# Altium schematic sheet Mini_Mainboard_sch.SchDoc
size A3
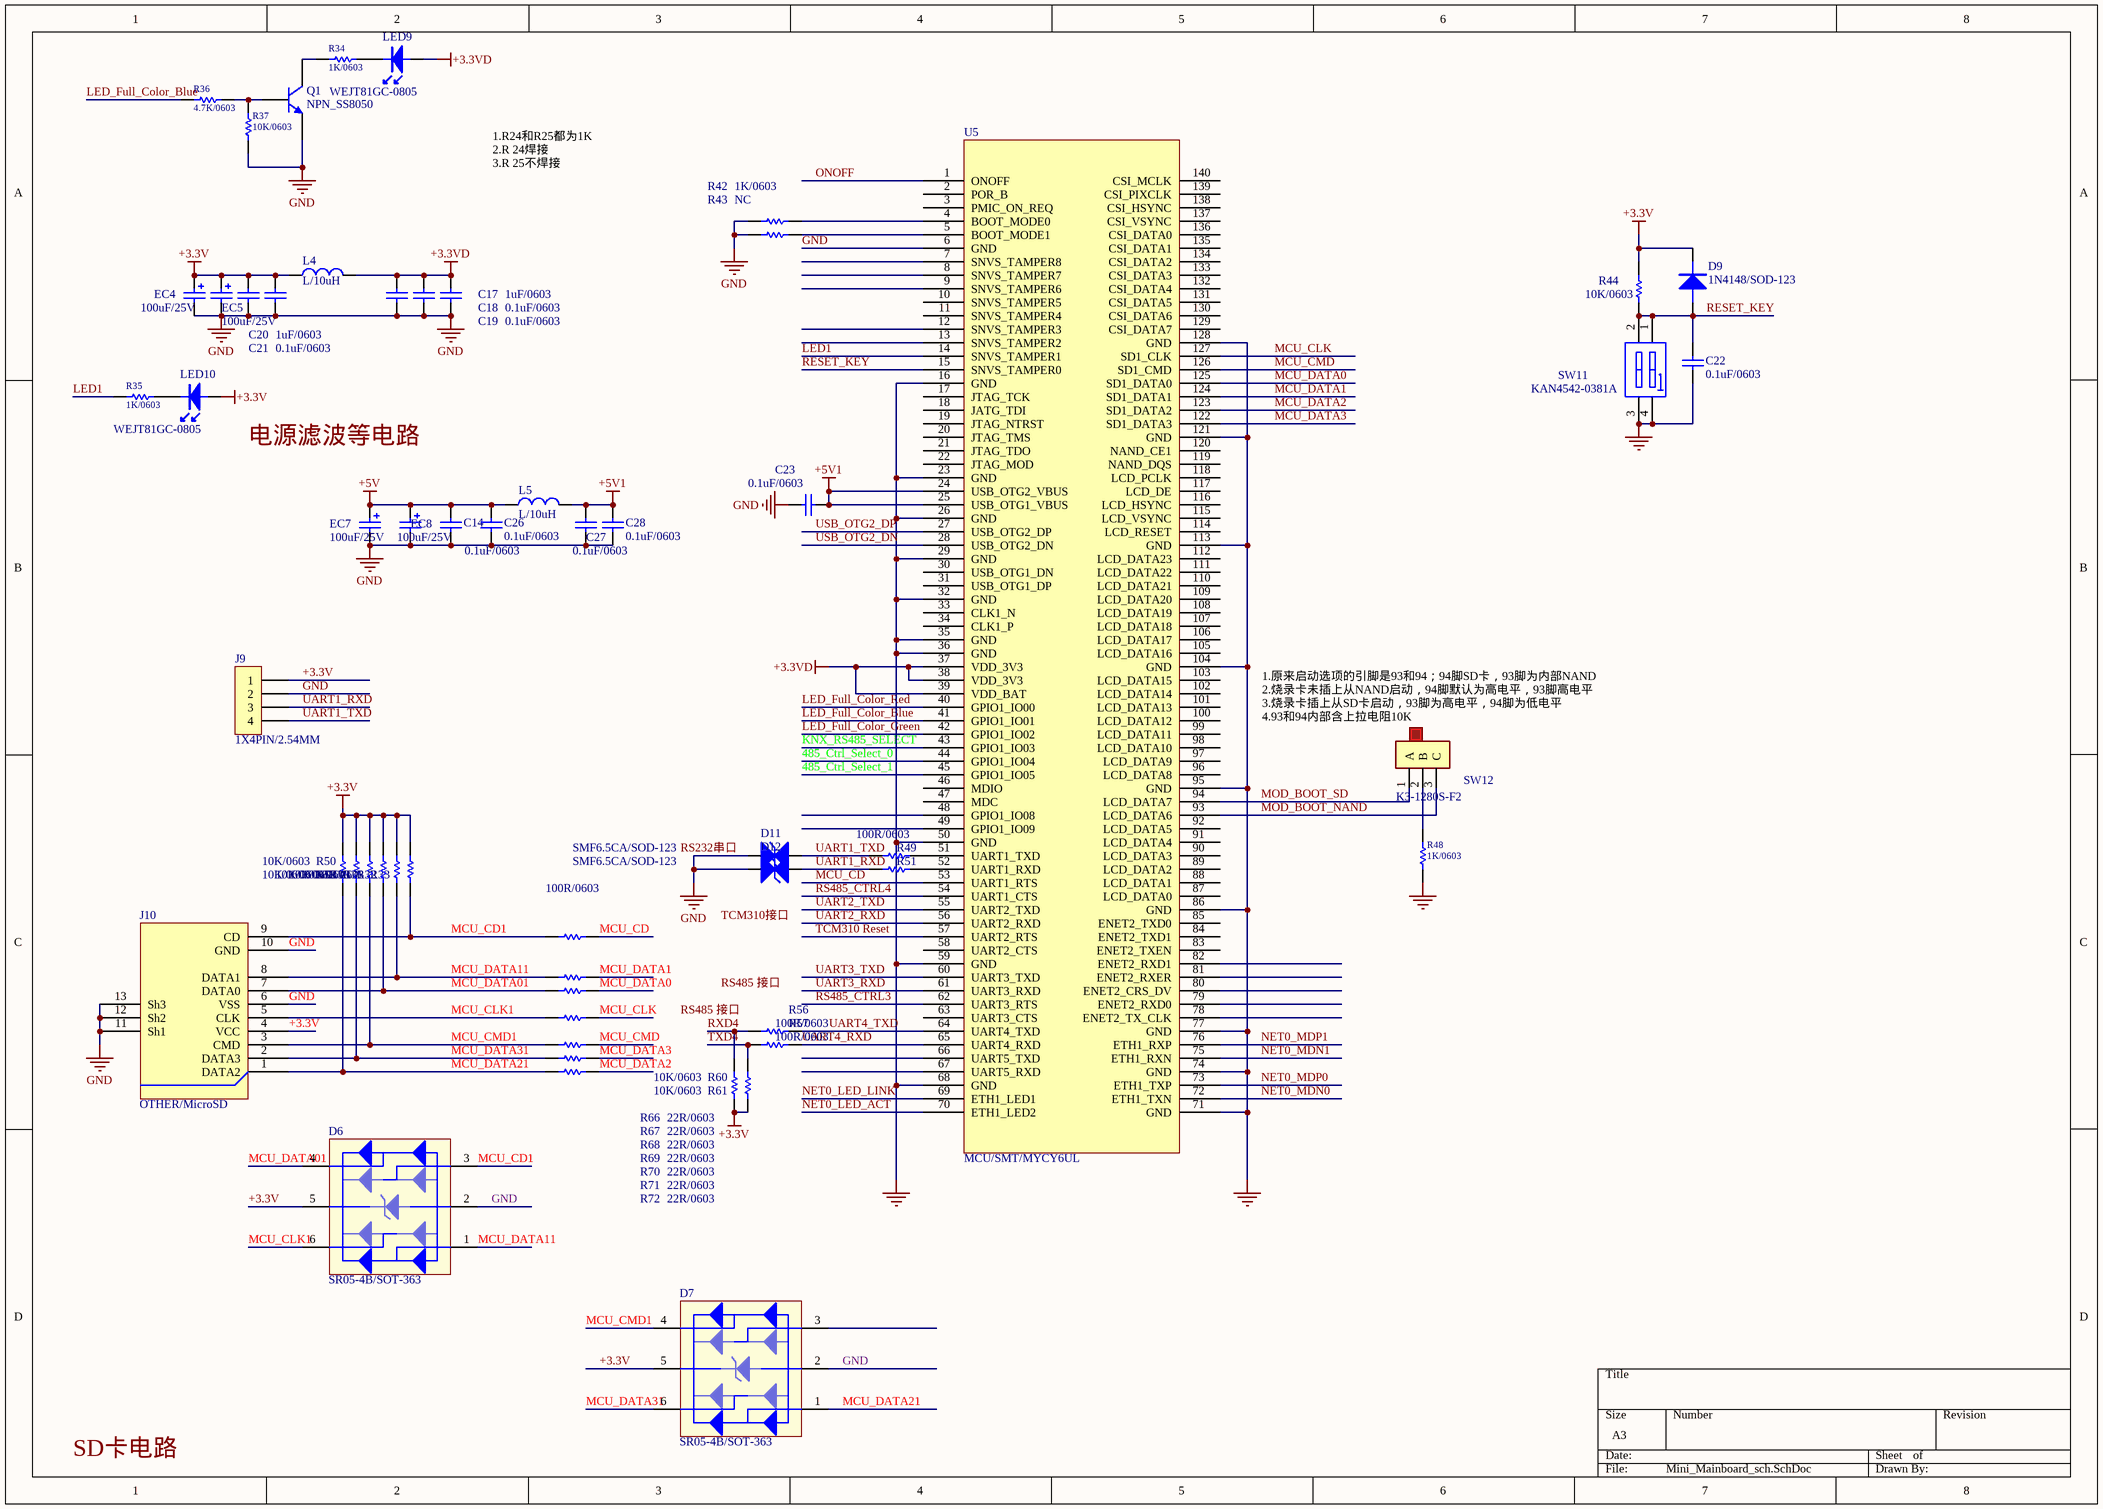
[diagram p0: Mini_Mainboard_sch.SchDoc]

## Parts
C14  0.1uF/0603  [CAP/SMT/0603C]
C17  1uF/0603  [CAP/SMT/0603C]
C18  0.1uF/0603  [CAP/SMT/0603C]
C19  0.1uF/0603  [CAP/SMT/0603C]
C20  1uF/0603  [CAP/SMT/0603C]
C21  0.1uF/0603  [CAP/SMT/0603C]
C22  0.1uF/0603  [CAP/SMT/0603C]
C23  0.1uF/0603  [CAP/SMT/0603C]
C26  0.1uF/0603  [CAP/SMT/0603C]
C27  0.1uF/0603  [CAP/SMT/0603C]
C28  0.1uF/0603  [CAP/SMT/0603C]
D6  SR05-4B/SOT-363  [TSOT-6L]
D7  SR05-4B/SOT-363  [TSOT-6L]
D9  1N4148/SOD-123  [D/SMT/SOD-123]
D11  SMF6.5CA/SOD-123  [D/SMT/SOD123]
D12  SMF6.5CA/SOD-123  [D/SMT/SOD123]
EC4  100uF/25V  [CAP/SMT/100UF/25V]
EC5  100uF/25V  [CAP/SMT/100UF/25V]
EC7  100uF/25V  [CAP/SMT/100UF/25V]
EC8  100uF/25V  [CAP/SMT/100UF/25V]
J9  1X4PIN/2.54MM  [CON/DIP/1×4PIN/2.54MM/插件端子]
J10  OTHER/MicroSD  [TF-01A]
L4  L/10uH  [L/SMT/0603L]
L5  L/10uH  [L/SMT/0603L]
LED9  WEJT81GC-0805  [D/SMT/LED/0805]
LED10  WEJT81GC-0805  [D/SMT/LED/0805]
Q1  NPN_SS8050  [BJT/SMT/SOT-23]
R30  10K/0603  [0603R]
R31  10K/0603  [0603R]
R32  10K/0603  [0603R]
R33  10K/0603  [0603R]
R34  1K/0603  [0603R]
R35  1K/0603  [0603R]
R36  4.7K/0603  [0603R]
R37  10K/0603  [0603R]
R42  1K/0603  [0603R]
R43  NC  [0603R]
R44  10K/0603  [0603R]
R48  1K/0603  [0603R]
R49  100R/0603  [0603R]
R50  10K/0603  [0603R]
R51  100R/0603  [0603R]
R52  10K/0603  [0603R]
R56  100R/0603  [0603R]
R57  100R/0603  [0603R]
R60  10K/0603  [0603R]
R61  10K/0603  [0603R]
R66  22R/0603  [0603R]
R67  22R/0603  [0603R]
R68  22R/0603  [0603R]
R69  22R/0603  [0603R]
R70  22R/0603  [0603R]
R71  22R/0603  [0603R]
R72  22R/0603  [0603R]
SW11  KAN4542-0381A  [SWITCH/KAN4542]
SW12  K3-1280S-F2  [SWITCH/K3-1280S-F2]
U5  MCU/SMT/MYCY6UL  [MYC140]

## Nets
+3.3V: C20.2 C21.2 D6.5 D7.5 D9.1(K) EC4.1 EC5.1 J9.1 J10.4(VCC) L4.1 LED10.2(A) R30.2 R31.2 R32.2 R33.2 R44.2 R50.2 R52.2 R60.2 R61.2
+3.3VD: C17.2 C18.2 C19.2 L4.2 LED9.2(A) U5.37(VDD_3V3) U5.38(VDD_3V3) U5.39(VDD_BAT)
+5V: C14.2 C26.2 EC7.1 EC8.1 L5.1
+5V1: C23.2 C27.2 C28.2 L5.2 U5.24(USB_OTG2_VBUS) U5.25(USB_OTG1_VBUS)
GND: C14.1 C17.1 C18.1 C19.1 C20.1 C21.1 C22.1 C23.1 C26.1 C27.1 C28.1 D6.2 D7.2 D11.2(K) D12.2(K) EC4.2 EC5.2 EC7.2 EC8.2 J9.2 J10.6(VSS) J10.10(GND) J10.11(Sh1) J10.12(Sh2) J10.13(Sh3) Q1.2(E) R37.1 R42.2 R43.2 R48.1 SW11.3(B2) SW11.4(B1) U5.6(GND) U5.16(GND) U5.23(GND) U5.26(GND) U5.29(GND) U5.32(GND) U5.35(GND) U5.36(GND) U5.50(GND) U5.59(GND) U5.68(GND) U5.71(GND) U5.74(GND) U5.77(GND) U5.86(GND) U5.95(GND) U5.104(GND) U5.113(GND) U5.121(GND) U5.128(GND)
485_Ctrl_Select_0: U5.44(GPIO1_IO04)
485_Ctrl_Select_1: U5.45(GPIO1_IO05)
KNX_RS485_SELECT: U5.43(GPIO1_IO03)
LED1: R35.1 U5.14(SNVS_TAMPER1)
LED_Full_Color_Blue: R36.1 U5.41(GPIO1_IO01)
LED_Full_Color_Green: U5.42(GPIO1_IO02)
LED_Full_Color_Red: U5.40(GPIO1_IO00)
MCU_CD: R66.1 U5.53(UART1_RTS)
MCU_CD1: D6.3 J10.9(CD) R33.1 R66.2
MCU_CLK: R69.1 U5.127(SD1_CLK)
MCU_CLK1: D6.6 J10.5(CLK) R69.2
MCU_CMD: R70.1 U5.126(SD1_CMD)
MCU_CMD1: D7.4 J10.3(CMD) R30.1 R70.2
MCU_DATA0: R68.1 U5.125(SD1_DATA0)
MCU_DATA01: D6.4 J10.7(DATA0) R31.1 R68.2
MCU_DATA1: R67.1 U5.124(SD1_DATA1)
MCU_DATA2: R72.1 U5.123(SD1_DATA2)
MCU_DATA3: R71.1 U5.122(SD1_DATA3)
MCU_DATA11: D6.1 J10.8(DATA1) R32.1 R67.2
MCU_DATA21: D7.1 J10.1(DATA2) R50.1 R72.2
MCU_DATA31: D7.6 J10.2(DATA3) R52.1 R71.2
MOD_BOOT_NAND: SW12.3(C) U5.93(LCD_DATA6)
MOD_BOOT_SD: SW12.1(A) U5.94(LCD_DATA7)
NET0_LED_ACT: U5.70(ETH1_LED2)
NET0_LED_LINK: U5.69(ETH1_LED1)
NET0_MDN0: U5.72(ETH1_TXN)
NET0_MDN1: U5.75(ETH1_RXN)
NET0_MDP0: U5.73(ETH1_TXP)
NET0_MDP1: U5.76(ETH1_RXP)
ONOFF: U5.1(ONOFF)
RESET_KEY: C22.2 D9.2(A) R44.1 SW11.1(A1) SW11.2(A2) U5.15(SNVS_TAMPER0)
RS485_CTRL3: U5.62(UART3_RTS)
RS485_CTRL4: U5.54(UART1_CTS)
RXD4: R56.2 R60.1
TCM310 Reset: U5.57(UART2_RTS)
TXD4: R57.2 R61.1
UART1_RXD: D12.1(A) J9.3 R51.1
UART1_TXD: D11.1(A) J9.4 R49.1
UART2_RXD: U5.56(UART2_RXD)
UART2_TXD: U5.55(UART2_TXD)
UART3_RXD: U5.61(UART3_RXD)
UART3_TXD: U5.60(UART3_TXD)
UART4_RXD: R57.1 U5.65(UART4_RXD)
UART4_TXD: R56.1 U5.64(UART4_TXD)
USB_OTG2_DN: U5.28(USB_OTG2_DN)
USB_OTG2_DP: U5.27(USB_OTG2_DP)
NetLED9_1: LED9.1(K) R34.1
NetLED10_1: LED10.1(K) R35.2
NetQ1_1: Q1.1(B) R36.2 R37.2
NetQ1_3: Q1.3(C) R34.2
NetR42_1: R42.1 U5.4(BOOT_MODE0)
NetR43_1: R43.1 U5.5(BOOT_MODE1)
NetR48_2: R48.2 SW12.2(B)
NetR49_2: R49.2 U5.51(UART1_TXD)
NetR51_2: R51.2 U5.52(UART1_RXD)

Not connected (* = marked no-connect by the designer): D7 3; U5 2(POR_B) 3(PMIC_ON_REQ) 7(SNVS_TAMPER8) 8(SNVS_TAMPER7) 9(SNVS_TAMPER6) 10(SNVS_TAMPER5) 11(SNVS_TAMPER4) 12(SNVS_TAMPER3) 13(SNVS_TAMPER2) 17(JTAG_TCK) 18(JATG_TDI) 19(JTAG_NTRST) 20(JTAG_TMS) 21(JTAG_TDO) 22(JTAG_MOD) 30(USB_OTG1_DN) 31(USB_OTG1_DP) 33(CLK1_N) 34(CLK1_P) 46(MDIO) 47(MDC) 48(GPIO1_IO08) 49(GPIO1_IO09) 58(UART2_CTS) 63(UART3_CTS) 66(UART5_TXD) 67(UART5_RXD) 78(ENET2_TX_CLK) 79(ENET2_RXD0) 80(ENET2_CRS_DV) 81(ENET2_RXER) 82(ENET2_RXD1) 83(ENET2_TXEN) 84(ENET2_TXD1) 85(ENET2_TXD0) 87(LCD_DATA0) 88(LCD_DATA1) 89(LCD_DATA2) 90(LCD_DATA3) 91(LCD_DATA4) 92(LCD_DATA5) 96(LCD_DATA8) 97(LCD_DATA9) 98(LCD_DATA10) 99(LCD_DATA11) 100(LCD_DATA12) 101(LCD_DATA13) 102(LCD_DATA14) 103(LCD_DATA15) 105(LCD_DATA16) 106(LCD_DATA17) 107(LCD_DATA18) 108(LCD_DATA19) 109(LCD_DATA20) 110(LCD_DATA21) 111(LCD_DATA22) 112(LCD_DATA23) 114(LCD_RESET) 115(LCD_VSYNC) 116(LCD_HSYNC) 117(LCD_DE) 118(LCD_PCLK) 119(NAND_DQS) 120(NAND_CE1) 129(CSI_DATA7) 130(CSI_DATA6) 131(CSI_DATA5) 132(CSI_DATA4) 133(CSI_DATA3) 134(CSI_DATA2) 135(CSI_DATA1) 136(CSI_DATA0) 137(CSI_VSYNC) 138(CSI_HSYNC) 139(CSI_PIXCLK) 140(CSI_MCLK)

## Notes on the sheet
- 1.R24和R25都为1K
  2.R 24焊接
  3.R 25不焊接
- (near SW12) 1.原来启动选项的引脚是93和94；94脚SD卡，93脚为内部NAND
  2.烧录卡未插上从NAND启动，94脚默认为高电平，93脚高电平
  3.烧录卡插上从SD卡启动，93脚为高电平，94脚为低电平
  4.93和94内部含上拉电阻10K
- Labels drawn without touching a wire or pin: MOD_BOOT_NAND, RS232串口, RS485 接口, SD卡电路, TCM310接口, 电源滤波等电路

## Library data of the parts
C14 C17-C23 C26-C28 = CAP/CAP/SMT/0603C
D6 D7 = D/TVS/SMT/SR05-4B/SOT-363
D9 = D/D/SMT/1N4148/SOD-123: VR=75V T(-65-175)P(0.5W)VF=0.6V
D11 D12 = D/TVS/SMT/SMF13CA/SOD-123
EC4 EC5 EC7 EC8 = CAP/AEC/SMT/100uF/25V
J9 = CON/DIP/1X4PIN/2.54MM: Connector
L4 L5 = L/BEAD/SMT/0603L
LED9 LED10 = D/LED/SMT/BL-HUF35A-TRB高亮红/0805
Q1 = BJT/NPN/SMT/SS8050/SOT-23: Published: *; Publisher: *; Manufacturer: *; Class: *; SubClass: *
R30-R33 R42-R44 R49-R52 R56 R57 R60 R61 R66-R72 = RES/RES/SMT/0603
R34-R37 R48 = Res: Resistor; Published: *; Publisher: *; Manufacturer: *; Class: *; SubClass: *; Value: *
SW11 = SWITCH/TACT/SMT/KAN4542-0381A: 4.5mm*4.5mm*3.8mm
SW12 = SWITCH/DIP/K3-1280S-F2